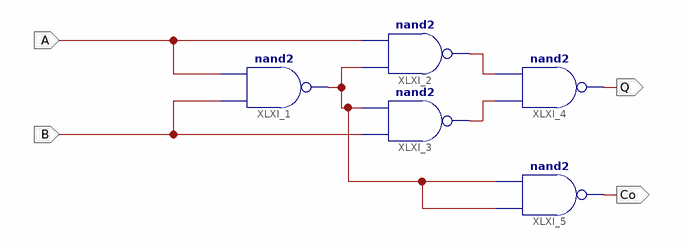
[diagram p0: schematic sheet 1]
// Xilinx ISE schematic experiment3.sch (spartan3e) as structural Verilog: 5 symbols, 4 ports
module experiment3 (
  input  A,
  input  B,
  output Q,
  output Co
);

  wire XLXN_3, XLXN_4, XLXN_12;

  nand XLXI_1 (XLXN_12, B, A);
  nand XLXI_2 (XLXN_3, XLXN_12, A);
  nand XLXI_3 (XLXN_4, B, XLXN_12);
  nand XLXI_4 (Q, XLXN_4, XLXN_3);
  nand XLXI_5 (Co, XLXN_12, XLXN_12);
endmodule
